# Altium schematic sheet kijelzo.SchDoc: LCD grafikus kijelzo
size A4; Author: Landi András; Organization: BME-AUT; DocumentNumber: 2; Revision: 21; SheetNumber: 2; SheetTotal: 3
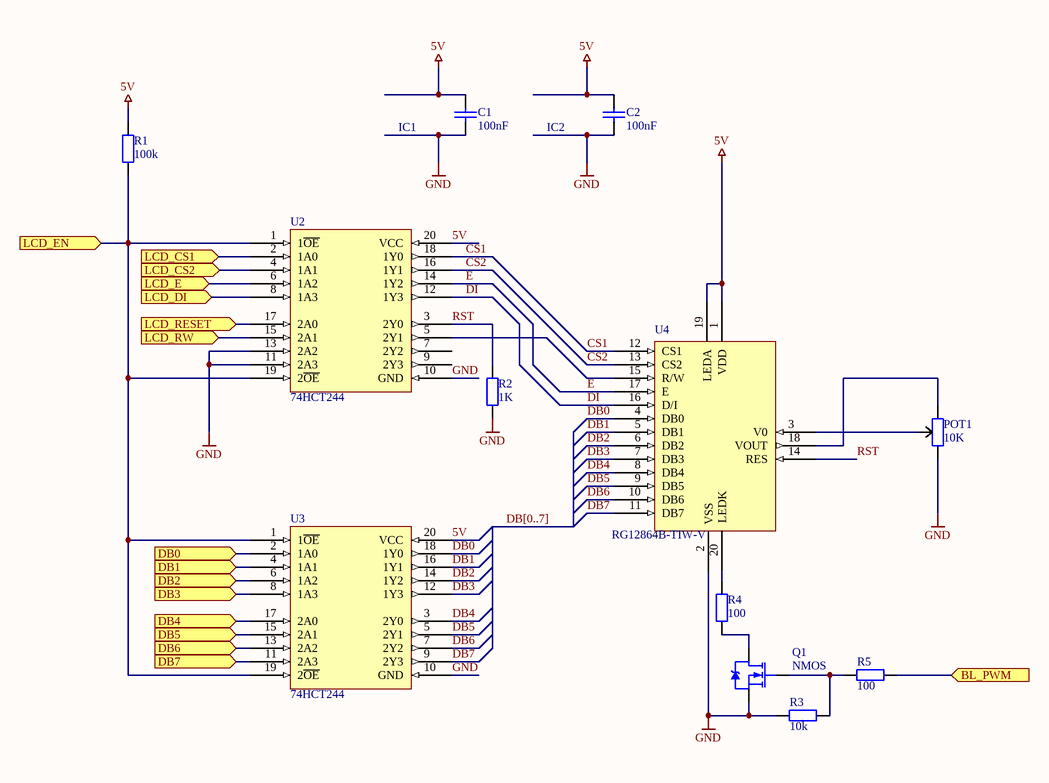
[diagram p0: kijelzo.SchDoc]

## Parts
C1  100nF  [FP_0805_CAP_085]
C2  100nF  [FP_0805_CAP_085]
POT1  10K  [potentiometer]
Q1  NMOS  [FP_SOT23-3]
R1  100k  [FP_0805_RES]
R2  1K  [FP_0805_RES]
R3  10k  [FP_0805_RES]
R4  100  [FP_0805_RES]
R5  100  [FP_0805_RES]
U2  74HCT244  [SO-20]
U3  74HCT244  [SO-20]
U4  RG12864B-TIW-V  [FP_LCD]

## Ports
BL_PWM (in), DB0 (in), DB1 (in), DB2 (in), DB3 (in), DB4 (in), DB5 (in), DB6 (in), DB7 (in), LCD_CS1 (in), LCD_CS2 (in), LCD_DI (in), LCD_E (in), LCD_EN (in), LCD_RESET (in), LCD_RW (in)

## Nets
5V: C1.2 C2.2 R1.2 U2.20(VCC) U3.20(VCC) U4.1(VDD) U4.19(LEDA)
GND: C1.1 C2.1 POT1.1 Q1.3(S) R2.1 R3.1 U2.10(GND) U2.11(2A3) U2.13(2A2) U3.10(GND) U4.2(VSS)
BL_PWM: R5.2 ; port BL_PWM
CS1: U2.18(1Y0) U4.12(CS1)
CS2: U2.16(1Y1) U4.13(CS2)
DB0: U3.2(1A0) ; port DB0
DB0: U3.18(1Y0) U4.4(DB0)  [a separate net that carries the same name]
DB1: U3.4(1A1) ; port DB1
DB1: U3.16(1Y1) U4.5(DB1)  [a separate net that carries the same name]
DB2: U3.6(1A2) ; port DB2
DB2: U3.14(1Y2) U4.6(DB2)  [a separate net that carries the same name]
DB3: U3.8(1A3) ; port DB3
DB3: U3.12(1Y3) U4.7(DB3)  [a separate net that carries the same name]
DB4: U3.3(2Y0) U4.8(DB4)
DB4: U3.17(2A0) ; port DB4  [a separate net that carries the same name]
DB5: U3.5(2Y1) U4.9(DB5)
DB5: U3.15(2A1) ; port DB5  [a separate net that carries the same name]
DB6: U3.7(2Y2) U4.10(DB6)
DB6: U3.13(2A2) ; port DB6  [a separate net that carries the same name]
DB7: U3.9(2Y3) U4.11(DB7)
DB7: U3.11(2A3) ; port DB7  [a separate net that carries the same name]
DI: U2.12(1Y3) U4.16(D/I)
E: U2.14(1Y2) U4.17(E)
LCD_CS1: U2.2(1A0) ; port LCD_CS1
LCD_CS2: U2.4(1A1) ; port LCD_CS2
LCD_DI: U2.8(1A3) ; port LCD_DI
LCD_E: U2.6(1A2) ; port LCD_E
LCD_EN: R1.1 U2.1(1~{OE}) U2.19(2~{OE}) U3.1(1~{OE}) U3.19(2~{OE}) ; port LCD_EN
LCD_RESET: U2.17(2A0) ; port LCD_RESET
LCD_RW: U2.15(2A1) ; port LCD_RW
RST: R2.2 U2.3(2Y0) U4.14(RES)
NetPOT1_2: POT1.2 U4.3(V0)
NetPOT1_3: POT1.3 U4.18(VOUT)
NetQ1_1: Q1.1(G) R3.2 R5.1
NetQ1_2: Q1.2(D) R4.1
NetR4_2: R4.2 U4.20(LEDK)
NetU2_5: U2.5(2Y1) U4.15(R/W)

Not connected (* = marked no-connect by the designer): U2 7(2Y2) 9(2Y3)

## Buses and harness runs
bus DB[0..7]

## Notes on the sheet
- (near C1) IC1
- (near C2) IC2
- Title
- Size:
- Date:
- A4
- Number:
- Time:
- Revision:
- Sheet
- of
- File:

## Library data of the parts
C1 = CAP: Capacitor; Tolerance: 10%; Voltage: 50V; Name: 100nF 0805 10% 50V X7R 0805B104K500NT; Supplier: Lomex; Reference: 82-13-46; Value: 100nF
C2 = CAP: Capacitor; Tolerance: 10%; Voltage: 50V; Name: 100nF 0805 10% 50V X7R 0805B104K500NT (FNG); Supplier: Lomex; Reference: 82-13-46; Value: 100nF
POT1 = POT: Potentiometer; Tolerance: 10%; Power: 0.5W; Name: 10K0 3296W-1-103R (KIC) HELI 25turn CERMET; Supplier: Lomex; Reference: 05-05-89; Value: 10K
Q1 = NMOS: NXP - BSP030,115 - MOSFET, N CH, 30V, 10A, SOT223; pin to pad: 2>3 3>2; Name: TSM2302CX (TSC) N-POWERFET 20V 3.2A Rds<0.065R Qg=7.8nC SOT-23 (SI2302); Supplier: Lomex; Reference: 86-02-83
R1 = RES: Resistor; Tolerance: 5%; Power: 0.125W; Name: 100K 0805 1% CR-05FL7--100K 0.125W (VIK); Supplier: Lomex; Reference: 80-11-10; Value: 100k
R2 = RES: Resistor; Tolerance: 5%; Power: 0.125W; Name: 1K00 0805 1% CR-05FL7----1K 0.125W (VIK); Supplier: Lomex; Reference: 80-10-86; Value: 1K
R3 = RES: Resistor; Tolerance: 1%; Power: 0.125W; Name: 10K0 0805 1% CR-05FL7---10K 0.125W (VIK); Supplier: Lomex; Reference: 80-10-98; Value: 10k
R4 R5 = RES: Resistor; Tolerance: 1%; Power: 0.125W; Name: 100R 0805 1% CR-05FL7--100R 0.125W (VIK); Supplier: Lomex; Reference: 80-10-74; Value: 100
U2 U3 = 74HCT244: Name: 74HCT244D,653 (NXP) 8xBUFFER/LINE DRIVER 3-STATE OUTPUT SO-20 WIDE; Supplier: Lomex; Reference: 87-00-95
U4 = LCD: Name: RG12864B-TIW-VRAYSTAR OPTRONICS; Supplier: TME; Reference: RG12864B-TIW-V